# Altium schematic sheet ADC16b_Pressure.SchDoc: ADC16b_Pressure
size A3; Project: STM32L073Z-EVAL; Date: Not used; ApprovedBy: Not used; CheckedBy: Not used; Author: Not used; CompanyName: STMicroelectronics; DrawnBy: Not used; Engineer: Not used; Organization: Not used; Address1: Not used; Address2: Not used; Address3: Not used; Address4: Not used; DocumentNumber: 8; Revision: Not used; SheetNumber: 9; SheetTotal: 13; CurrentTime: Not used; CurrentDate: Not used; Time: Not used; DocumentFullPathAndName: Not used; DocumentName: Not used; ModifiedDate: Not used; ImagePath: Not used; ProjectName: Not used; Application_BuildNumber: Not used
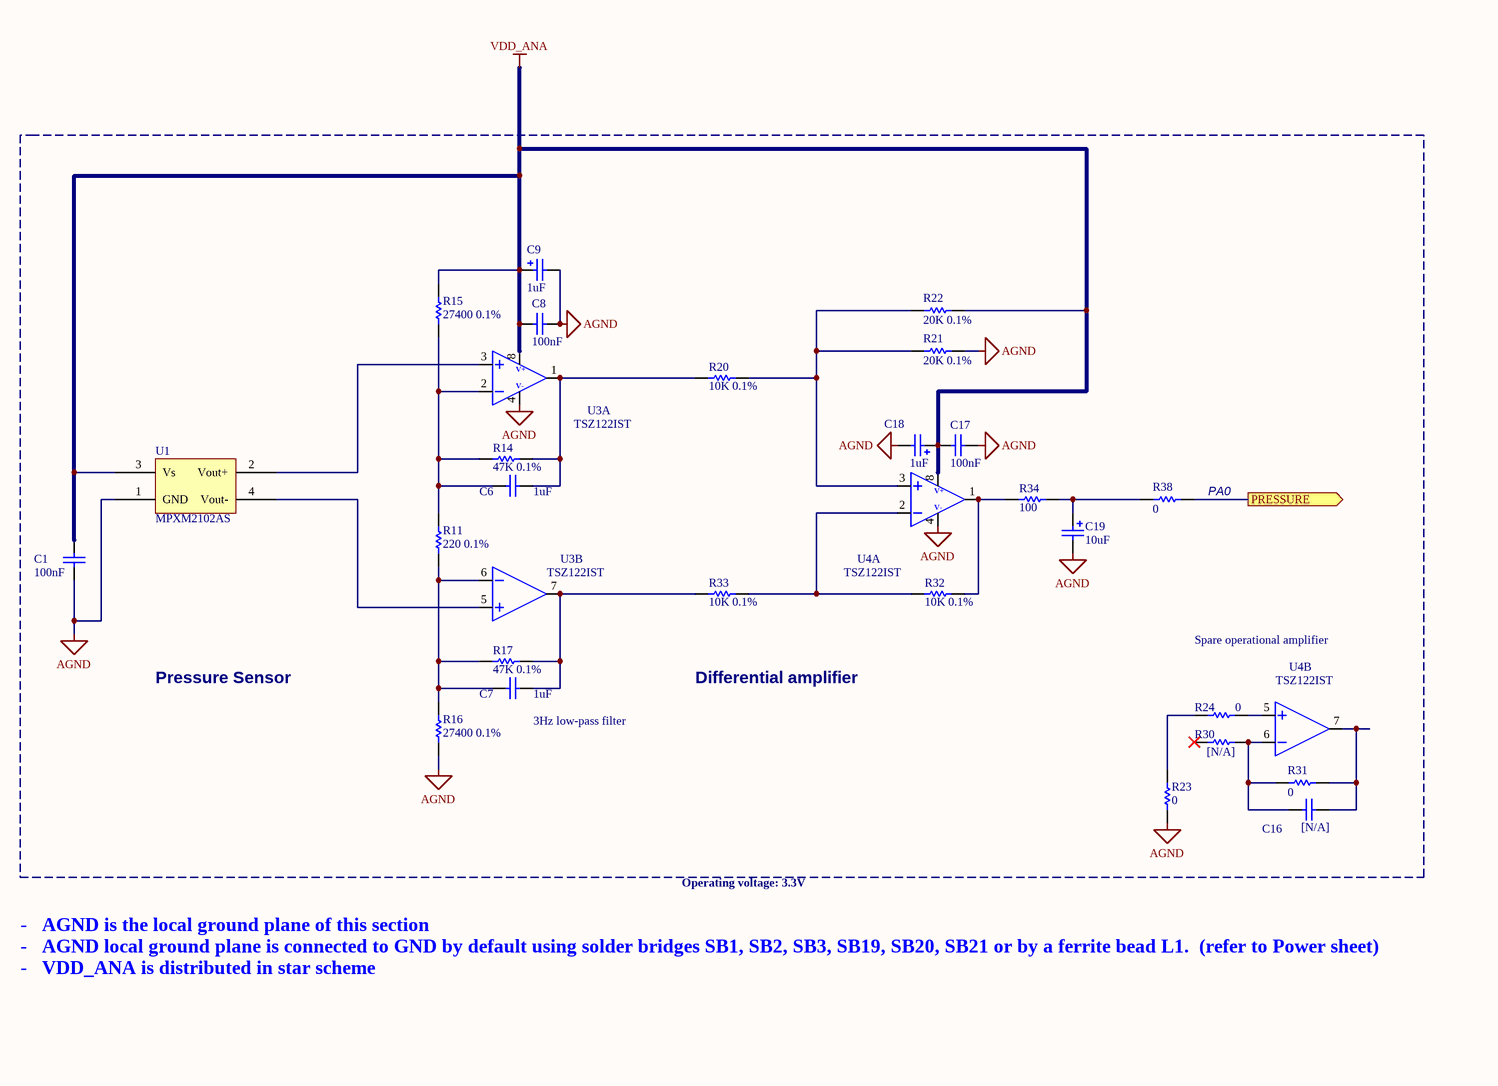
[diagram p0: ADC16b_Pressure.SchDoc]

## Parts
C1  100nF  [0402C]
C6  1uF  [0603C]
C7  1uF  [0603C]
C8  100nF  [0402C]
C9  1uF  [TAN-A]
C16  [N/A]  [0603C]
C17  100nF  [0402C]
C18  1uF  [TAN-A]
C19  10uF  [TAN-A]
R11  220 0.1%  [0603R]
R14  47K 0.1%  [0603R]
R15  27400 0.1%  [0603R]
R16  27400 0.1%  [0603R]
R17  47K 0.1%  [0603R]
R20  10K 0.1%  [0603R]
R21  20K 0.1%  [0603R]
R22  20K 0.1%  [0603R]
R23  0  [0603R]
R24  0  [0603R]
R30  [N/A]  [0603R]
R31  0  [0603R]
R32  10K 0.1%  [0603R]
R33  10K 0.1%  [0603R]
R34  100  [0402R]
R38  0  [0603R]
U1  MPXM2102AS  [SENSOR_MPXM2102AS]
U3  TSZ122IST  [MSOP8_0R65_3X4R9]  (parts A,B of 2)
U4  TSZ122IST  [MSOP8_0R65_3X4R9]  (parts A,B of 2)

## Ports
PRESSURE (out)

## Nets
AGND: C1.1 C8.1 C9.2 C17.1 C18.2 C19.2 R16.2 R21.2 R23.2 U1.1(GND) U3.4 U4.4
VDD_ANA: C1.2 C8.2 C9.1 C17.2 C18.1 R15.1 R22.2 U1.3(Vs) U3.8 U4.8
PRESSURE: R38.2 ; port PRESSURE
NetC6_1: C6.1 R11.1 R14.2 R15.2 U3.2
NetC6_2: C6.2 R14.1 R20.2 U3.1
NetC7_1: C7.1 R11.2 R16.1 R17.2 U3.6
NetC7_2: C7.2 R17.1 R33.2 U3.7
NetC16_1: C16.1 R31.1 U4.7
NetC16_2: C16.2 R30.1 R31.2 U4.6
NetC19_1: C19.1 R34.1 R38.1
NetR20_1: R20.1 R21.1 R22.1 U4.3
NetR23_1: R23.1 R24.2
NetR24_1: R24.1 U4.5
NetR32_1: R32.1 R34.2 U4.1
NetR32_2: R32.2 R33.1 U4.2
NetU1_2: U1.2(Vout+) U3.3
NetU1_4: U1.4(Vout-) U3.5

Not connected (* = marked no-connect by the designer): R30 2*

## Notes on the sheet
- (near R38) PA0
- Pressure Sensor
- Differential amplifier
- Spare operational amplifier
- (near C7) 3Hz low-pass filter
- Operating voltage: 3.3V
- -   AGND is the local ground plane of this section
  -   AGND local ground plane is connected to GND by default using solder bridges SB1, SB2, SB3, SB19, SB20, SB21 or by a ferrite bead L1.  (refer to Power sheet)
  -   VDD_ANA is distributed in star scheme
- Title:
- Project:
- Size:
- Revision:
- Variant:
- A3
- -
- Date:
- Reference:
- Sheet:
- of
- (in symbol AOP-8PINS, part A) V+; V-

## Library data of the parts
C1 C8 C17 = CAP: Capacitor; Value: 100pF; Ordered by: Subcon; Published: 8-Jun-2000; Revision: July-2002: Re-released for DXP Platform.; Publisher: Altium Limited; ECCN_US/EU: n/a
C6 C7 = CAP: Capacitor; Value: 100nF; Ordered by: Subcon; Published: 8-Jun-2000; Revision: July-2002: Re-released for DXP Platform.; Publisher: Altium Limited; ECCN_US/EU: n/a
C9 C18 = Cap Pol1: Polarized Capacitor; Ordered by: Subcon; Published: 8-Jun-2000; Revision: July-2002: Re-released for DXP Platform.; Publisher: Altium Limited; Value: 1uF; ECCN_US/EU: n/a
C16 = cap: Capacitor; Value: 100pF; Ordered by: Subcon; Fitted: NO; Published: 8-Jun-2000; Revision: July-2002: Re-released for DXP Platform.; Publisher: Altium Limited; ECCN_US/EU: n/a
C19 = Cap Pol1: Polarized Capacitor (Radial); Ordered by: Subcon; Published: 8-Jun-2000; Revision: July-2002: Re-released for DXP Platform.; Publisher: Altium Limited; Value: 10uF; ECCN_US/EU: n/a
R11 R14-R17 R20-R24 R31-R34 R38 = Res1: Resistor; Value: 1K; Ordered by: Subcon; Published: 8-Jun-2000; Revision: July-2002: Re-released for DXP Platform.; Publisher: Altium Limited; ECCN_US/EU: n/a
R30 = Res1: Resistor; Value: 1K; Ordered by: Subcon; Fitted: NO; Published: 8-Jun-2000; Revision: July-2002: Re-released for DXP Platform.; Publisher: Altium Limited; ECCN_US/EU: n/a
U1 = MPX2102: Manuf_1: Freescale; Manuf_Part_2: MPXM2102AST1; Ordered by: Subcon; ECCN_US/EU: EAR99/NEC; Manuf_2: Freescale; Manuf_Part_1: MPXM2102AS
U3 U4 = AOP-8PINS: Ordered by: ST; ECCN_US/EU: EAR99/NEC; Ref St: 9177443; Manuf_1: ST; Manuf_Part_1: TSZ122IST